# Altium schematic sheet [8] - SENSORLESS.SchDoc
size A
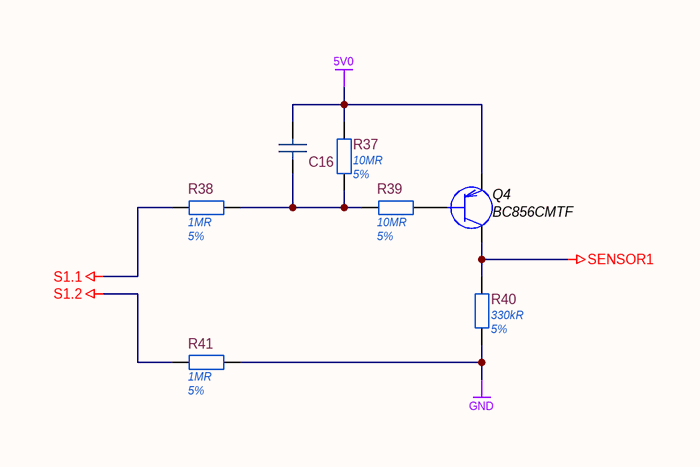
[diagram p0: [8] - SENSORLESS.SchDoc]

## Parts
C16  AC0805KRX7R9BB103  [CH0805C]  (value not drawn)
Q4  BC856CMTF  [SOT23-3]
R37  Resistance: 10MR  Tolerance: 5%  [CH0805R]  (hidden comment: RC0805JR-0710ML)
R38  Resistance: 1MR  Tolerance: 5%  [CH0805R]  (hidden comment: RC0805JR-071ML)
R39  Resistance: 10MR  Tolerance: 5%  [CH0805R]  (hidden comment: RC0805JR-0710ML)
R40  Resistance: 330kR  Tolerance: 5%  [CH0805R]  (hidden comment: RC0805JR-07330KL)
R41  Resistance: 1MR  Tolerance: 5%  [CH0805R]  (hidden comment: RC0805JR-071ML)

## Nets
5V0: C16.1 Q4.2(B) R37.2
GND: R40.1 R41.2
S1.1: R38.1
S1.2: R41.1
SENSOR1: Q4.3(B) R40.2
NetC16_2: C16.2 R37.1 R38.2 R39.2
NetQ4_1: Q4.1(B) R39.1

## Library data of the parts
C16 = AC0805KRX7R9BB103: CAP CER 10000PF 50V X7R 0805; Manufacturer 1: Yageo; Supplier 1: Digi-Key; Manufacturer Part Number 1: AC0805KRX7R9BB103; Stock 1: 13850; Pricing 1: 1=0,20000, 10=0,13800, 100=0,07000, 500=0,04792, 1000=0,04238 (USD); RoHS: No; Lead Free: Lead Free; ComponentLink1URL: http://www.yageo.com/NewPortal/_en/search/productDocs.jsp?YageoPartNumber=AC0805KRX7R9BB103&src-supplier=Digi-Key; ComponentLink1Description: http://www.yageo.com/NewPortal/_en/search/productDocs.jsp?YageoPartNumber=AC0805KRX7R9BB103&src-supplier=Digi-Key; Supplier Part Number 1: 311-3174-1-ND
Q4 = BC856CMTF: TRANS PNP 65V 0.1A SOT-23; Manufacturer: ON Semiconductor; MPN: BC856CMTF; Supplier 1: Digi-Key; Supplier 2: *; PackageReference: SOT-23-3; Value: BC856CMTF
R37 R39 = RC0805JR-0710ML: RES SMD 10M OHM 5% 1/8W 0805; Manufacturer 1: Yageo; Temperature Coefficient: 100ppm/°C; Power Rating: 125mW; Voltage Rating: 150V; Supplier 1: Digi-Key; Manufacturer Part Number 1: RC0805JR-0710ML; Stock 1: 307176; Pricing 1: 1=0,10000, 10=0,03600, 100=0,01460, 1000=0,00654, 2500=0,00568 (USD); RoHS: Yes; Case/Package: 0805; Contact Plating: Tin,Matte,Lead; Case Code (Imperial): 0805; Case Code (Metric): 2012; Min Operating Temperature: -55°C; Max Operating Temperature: 155°C; Composition: Thick Film; Packaging: Tape and Reel; Package Quantity: 1; Termination: SMD/SMT; Number of Terminations: 2; Military Standard: Not; Max Power Dissipation: 125mW; Features: Moisture Resistant; Length: 0.079inch; Height: 0.024inch; Width: 0.049inch; Depth: 1.25mm; Radiation Hardening: No; REACH SVHC: Unknown; Lead Free: Lead Free; ComponentLink1URL: https://datasheet.ciiva.com/12667/rc0805-12667352.pdf?src-supplier=Mouser; ComponentLink1Description: https://datasheet.ciiva.com/12667/rc0805-12667352.pdf?src-supplier=Mouser; ComponentLink2URL: https://datasheet.ciiva.com/2456/pyu-r-int-thick-7-2456140.pdf?src-supplier=Digi-Key; ComponentLink2Description: https://datasheet.ciiva.com/2456/pyu-r-int-thick-7-2456140.pdf?src-supplier=Digi-Key; ComponentLink3URL: https://datasheet.ciiva.com/2456/pyu-r-int-thick-7-2456141.pdf?src-supplier=Digi-Key; ComponentLink3Description: https://datasheet.ciiva.com/2456/pyu-r-int-thick-7-2456141.pdf?src-supplier=Digi-Key; ComponentLink4URL: https://datasheet.ciiva.com/2456/pyu-r-int-thick-7-2456142.pdf?src-supplier=Digi-Key; ComponentLink4Description: https://datasheet.ciiva.com/2456/pyu-r-int-thick-7-2456142.pdf?src-supplier=Digi-Key; Supplier Part Number 1: 311-10MARCT-ND
R38 R41 = RC0805JR-071ML: RES SMD 1M OHM 5% 1/8W 0805; Manufacturer 1: Yageo; Temperature Coefficient: 100ppm/°C; Power Rating: 125mW; Voltage Rating: 150V; Supplier 1: Digi-Key; Manufacturer Part Number 1: RC0805JR-071ML; Stock 1: 1427349; Pricing 1: 1=0,10000, 10=0,03600, 100=0,01460, 1000=0,00654, 2500=0,00568 (USD); RoHS: Yes; Case/Package: 0805; Case Code (Imperial): 0805; Case Code (Metric): 2012; Contact Plating: Tin,Lead,Matte; Min Operating Temperature: -55°C; Max Operating Temperature: 155°C; Composition: Thick Film; Packaging: Tape and Reel; Package Quantity: 1; Termination: SMD/SMT; Number of Terminations: 2; Military Standard: Not; Max Power Dissipation: 125mW; Features: Moisture Resistant; Length: 0.079inch; Height: 0.024inch; Width: 0.049inch; Depth: 1.25mm; Radiation Hardening: No; REACH SVHC: Unknown; Lead Free: Lead Free; ComponentLink1URL: https://datasheet.ciiva.com/2519/pyu-r-int-thick-7-2519301.pdf?src-supplier=Digi-Key; ComponentLink1Description: https://datasheet.ciiva.com/2519/pyu-r-int-thick-7-2519301.pdf?src-supplier=Digi-Key; ComponentLink2URL: https://datasheet.ciiva.com/2519/pyu-r-int-thick-7-2519302.pdf?src-supplier=Digi-Key; ComponentLink2Description: https://datasheet.ciiva.com/2519/pyu-r-int-thick-7-2519302.pdf?src-supplier=Digi-Key; ComponentLink3URL: https://datasheet.ciiva.com/16796/rc0805-16796344.pdf?src-supplier=Future+Electronics; ComponentLink3Description: https://datasheet.ciiva.com/16796/rc0805-16796344.pdf?src-supplier=Future+Electronics; ComponentLink4URL: https://datasheet.ciiva.com/7941/442941-7941913.pdf?src-supplier=Element14; ComponentLink4Description: https://datasheet.ciiva.com/7941/442941-7941913.pdf?src-supplier=Element14; ComponentLink5URL: https://datasheet.ciiva.com/7941/442941-7941914.pdf?src-supplier=Element14; ComponentLink5Description: https://datasheet.ciiva.com/7941/442941-7941914.pdf?src-supplier=Element14; ComponentLink6URL: https://datasheet.ciiva.com/46395/444164-46395132.pdf?src-supplier=Element14; ComponentLink6Description: https://datasheet.ciiva.com/46395/444164-46395132.pdf?src-supplier=Element14; Supplier Part Number 1: 311-1.0MARCT-ND
R40 = RC0805JR-07330KL: RES SMD 330K OHM 5% 1/8W 0805; Manufacturer 1: Yageo; Temperature Coefficient: 100ppm/°C; Power Rating: 125mW; Voltage Rating: 150V; Supplier 1: Digi-Key; Manufacturer Part Number 1: RC0805JR-07330KL; Stock 1: 141358; Pricing 1: 1=0,10000, 10=0,03600, 100=0,01460, 1000=0,00654, 2500=0,00568 (USD); RoHS: Yes; Case/Package: 0805; Number of Pins: 2; Contact Plating: Tin,Matte,Lead; Case Code (Imperial): 0805; Case Code (Metric): 2012; Min Operating Temperature: -55°C; Max Operating Temperature: 155°C; Composition: Thick Film; Packaging: Tape and Reel; Voltage Rating (DC): 150V; Package Quantity: 1; Termination: SMD/SMT; Number of Terminations: 2; Military Standard: Not; Max Power Dissipation: 125mW; Features: Moisture Resistant; Length: 0.079inch; Height: 0.024inch; Width: 0.049inch; Depth: 1.25mm; Radiation Hardening: No; REACH SVHC: No SVHC; Lead Free: Lead Free; ComponentLink1URL: https://datasheet.ciiva.com/5557/rc0805-5557968.pdf?src-supplier=Mouser; ComponentLink1Description: https://datasheet.ciiva.com/5557/rc0805-5557968.pdf?src-supplier=Mouser; ComponentLink2URL: https://datasheet.ciiva.com/2456/pyu-r-int-thick-7-2456375.pdf?src-supplier=Digi-Key; ComponentLink2Description: https://datasheet.ciiva.com/2456/pyu-r-int-thick-7-2456375.pdf?src-supplier=Digi-Key; ComponentLink3URL: https://datasheet.ciiva.com/17332/rc0805-17332090.pdf?src-supplier=Future+Electronics; ComponentLink3Description: https://datasheet.ciiva.com/17332/rc0805-17332090.pdf?src-supplier=Future+Electronics; ComponentLink4URL: https://datasheet.ciiva.com/2456/pyu-r-int-thick-7-2456377.pdf?src-supplier=Digi-Key; ComponentLink4Description: https://datasheet.ciiva.com/2456/pyu-r-int-thick-7-2456377.pdf?src-supplier=Digi-Key; ComponentLink5URL: https://datasheet.ciiva.com/2456/pyu-r-int-thick-7-2456376.pdf?src-supplier=Digi-Key; ComponentLink5Description: https://datasheet.ciiva.com/2456/pyu-r-int-thick-7-2456376.pdf?src-supplier=Digi-Key; Supplier Part Number 1: 311-330KARCT-ND